# EAGLE design EIB64-ST4-FB-LSplit (EAGLE 9.6.1)
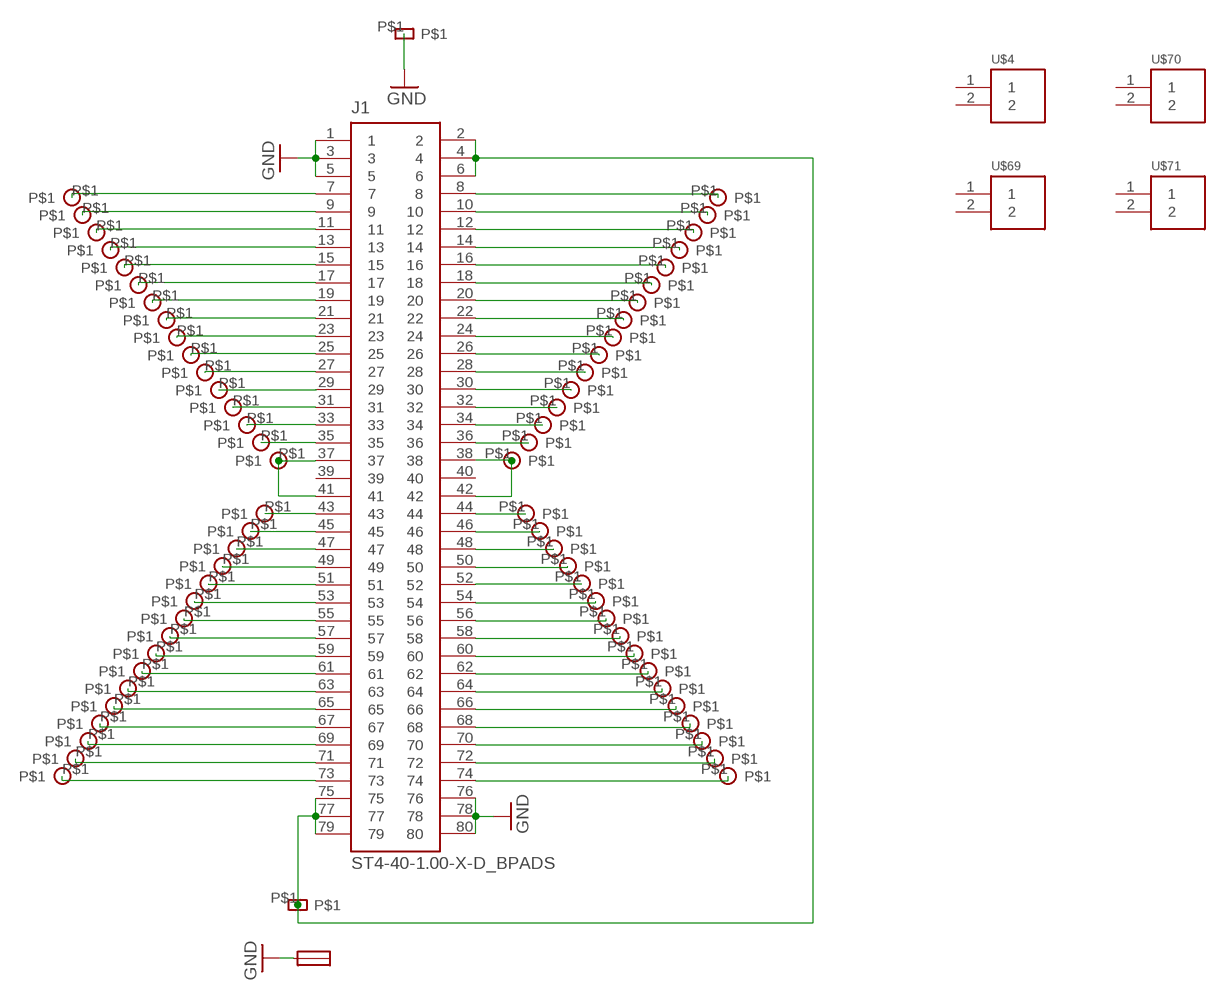
[diagram p0: schematic, sheet 1]

## Parts
J1  ST4-40-1.00-X-D_BPADS  [ST4-40-1.00-X-D_BPADS]
U$1  EIB-GND-HOLE-PAD-SMALL  [EIB-GND-HOLE-PAD-SMALL]
U$2  JMP-PAD-SMALL  [JMP-PAD-SMALL]
U$3  EIB-GND-HOLE-PAD-SMALL  [EIB-GND-HOLE-PAD-SMALL]
U$4  THCONLY_TMS-102-XX-XX-S  [THCONLY_TMS-102-XX-XX-S]
U$5  EIB-TETRODE-HOLE-RS-PAD  [EIB-TETRODE-HOLE-RS-PAD]
U$6  EIB-TETRODE-HOLE-RS-PAD  [EIB-TETRODE-HOLE-RS-PAD]
U$7  EIB-TETRODE-HOLE-RS-PAD  [EIB-TETRODE-HOLE-RS-PAD]
U$8  EIB-TETRODE-HOLE-RS-PAD  [EIB-TETRODE-HOLE-RS-PAD]
U$9  EIB-TETRODE-HOLE-RS-PAD  [EIB-TETRODE-HOLE-RS-PAD]
U$10  EIB-TETRODE-HOLE-RS-PAD  [EIB-TETRODE-HOLE-RS-PAD]
U$11  EIB-TETRODE-HOLE-RS-PAD  [EIB-TETRODE-HOLE-RS-PAD]
U$12  EIB-TETRODE-HOLE-RS-PAD  [EIB-TETRODE-HOLE-RS-PAD]
U$13  EIB-TETRODE-HOLE-RS-PAD  [EIB-TETRODE-HOLE-RS-PAD]
U$14  EIB-TETRODE-HOLE-RS-PAD  [EIB-TETRODE-HOLE-RS-PAD]
U$15  EIB-TETRODE-HOLE-RS-PAD  [EIB-TETRODE-HOLE-RS-PAD]
U$16  EIB-TETRODE-HOLE-RS-PAD  [EIB-TETRODE-HOLE-RS-PAD]
U$17  EIB-TETRODE-HOLE-RS-PAD  [EIB-TETRODE-HOLE-RS-PAD]
U$18  EIB-TETRODE-HOLE-RS-PAD  [EIB-TETRODE-HOLE-RS-PAD]
U$19  EIB-TETRODE-HOLE-RS-PAD  [EIB-TETRODE-HOLE-RS-PAD]
U$20  EIB-TETRODE-HOLE-RS-PAD  [EIB-TETRODE-HOLE-RS-PAD]
U$21  EIB-TETRODE-HOLE-RS-PAD  [EIB-TETRODE-HOLE-RS-PAD]
U$22  EIB-TETRODE-HOLE-RS-PAD  [EIB-TETRODE-HOLE-RS-PAD]
U$23  EIB-TETRODE-HOLE-RS-PAD  [EIB-TETRODE-HOLE-RS-PAD]
U$24  EIB-TETRODE-HOLE-RS-PAD  [EIB-TETRODE-HOLE-RS-PAD]
U$25  EIB-TETRODE-HOLE-RS-PAD  [EIB-TETRODE-HOLE-RS-PAD]
U$26  EIB-TETRODE-HOLE-RS-PAD  [EIB-TETRODE-HOLE-RS-PAD]
U$27  EIB-TETRODE-HOLE-RS-PAD  [EIB-TETRODE-HOLE-RS-PAD]
U$28  EIB-TETRODE-HOLE-RS-PAD  [EIB-TETRODE-HOLE-RS-PAD]
U$29  EIB-TETRODE-HOLE-RS-PAD  [EIB-TETRODE-HOLE-RS-PAD]
U$30  EIB-TETRODE-HOLE-RS-PAD  [EIB-TETRODE-HOLE-RS-PAD]
U$31  EIB-TETRODE-HOLE-RS-PAD  [EIB-TETRODE-HOLE-RS-PAD]
U$32  EIB-TETRODE-HOLE-RS-PAD  [EIB-TETRODE-HOLE-RS-PAD]
U$33  EIB-TETRODE-HOLE-RS-PAD  [EIB-TETRODE-HOLE-RS-PAD]
U$34  EIB-TETRODE-HOLE-RS-PAD  [EIB-TETRODE-HOLE-RS-PAD]
U$35  EIB-TETRODE-HOLE-RS-PAD  [EIB-TETRODE-HOLE-RS-PAD]
U$36  EIB-TETRODE-HOLE-RS-PAD  [EIB-TETRODE-HOLE-RS-PAD]
U$37  EIB-TETRODE-HOLE-RS-PAD  [EIB-TETRODE-HOLE-RS-PAD]
U$38  EIB-TETRODE-HOLE-RS-PAD  [EIB-TETRODE-HOLE-RS-PAD]
U$39  EIB-TETRODE-HOLE-RS-PAD  [EIB-TETRODE-HOLE-RS-PAD]
U$40  EIB-TETRODE-HOLE-RS-PAD  [EIB-TETRODE-HOLE-RS-PAD]
U$41  EIB-TETRODE-HOLE-RS-PAD  [EIB-TETRODE-HOLE-RS-PAD]
U$42  EIB-TETRODE-HOLE-RS-PAD  [EIB-TETRODE-HOLE-RS-PAD]
U$43  EIB-TETRODE-HOLE-RS-PAD  [EIB-TETRODE-HOLE-RS-PAD]
U$44  EIB-TETRODE-HOLE-RS-PAD  [EIB-TETRODE-HOLE-RS-PAD]
U$45  EIB-TETRODE-HOLE-RS-PAD  [EIB-TETRODE-HOLE-RS-PAD]
U$46  EIB-TETRODE-HOLE-RS-PAD  [EIB-TETRODE-HOLE-RS-PAD]
U$47  EIB-TETRODE-HOLE-RS-PAD  [EIB-TETRODE-HOLE-RS-PAD]
U$48  EIB-TETRODE-HOLE-RS-PAD  [EIB-TETRODE-HOLE-RS-PAD]
U$49  EIB-TETRODE-HOLE-RS-PAD  [EIB-TETRODE-HOLE-RS-PAD]
U$50  EIB-TETRODE-HOLE-RS-PAD  [EIB-TETRODE-HOLE-RS-PAD]
U$51  EIB-TETRODE-HOLE-RS-PAD  [EIB-TETRODE-HOLE-RS-PAD]
U$52  EIB-TETRODE-HOLE-RS-PAD  [EIB-TETRODE-HOLE-RS-PAD]
U$53  EIB-TETRODE-HOLE-RS-PAD  [EIB-TETRODE-HOLE-RS-PAD]
U$54  EIB-TETRODE-HOLE-RS-PAD  [EIB-TETRODE-HOLE-RS-PAD]
U$55  EIB-TETRODE-HOLE-RS-PAD  [EIB-TETRODE-HOLE-RS-PAD]
U$56  EIB-TETRODE-HOLE-RS-PAD  [EIB-TETRODE-HOLE-RS-PAD]
U$57  EIB-TETRODE-HOLE-RS-PAD  [EIB-TETRODE-HOLE-RS-PAD]
U$58  EIB-TETRODE-HOLE-RS-PAD  [EIB-TETRODE-HOLE-RS-PAD]
U$59  EIB-TETRODE-HOLE-RS-PAD  [EIB-TETRODE-HOLE-RS-PAD]
U$60  EIB-TETRODE-HOLE-RS-PAD  [EIB-TETRODE-HOLE-RS-PAD]
U$61  EIB-TETRODE-HOLE-RS-PAD  [EIB-TETRODE-HOLE-RS-PAD]
U$62  EIB-TETRODE-HOLE-RS-PAD  [EIB-TETRODE-HOLE-RS-PAD]
U$63  EIB-TETRODE-HOLE-RS-PAD  [EIB-TETRODE-HOLE-RS-PAD]
U$64  EIB-TETRODE-HOLE-RS-PAD  [EIB-TETRODE-HOLE-RS-PAD]
U$65  EIB-TETRODE-HOLE-RS-PAD  [EIB-TETRODE-HOLE-RS-PAD]
U$66  EIB-TETRODE-HOLE-RS-PAD  [EIB-TETRODE-HOLE-RS-PAD]
U$67  EIB-TETRODE-HOLE-RS-PAD  [EIB-TETRODE-HOLE-RS-PAD]
U$68  EIB-TETRODE-HOLE-RS-PAD  [EIB-TETRODE-HOLE-RS-PAD]
U$69  THCONLY_TMS-102-XX-XX-S  [THCONLY_TMS-102-XX-XX-S]
U$70  THCONLY_TMS-102-XX-XX-S  [THCONLY_TMS-102-XX-XX-S]
U$71  THCONLY_TMS-102-XX-XX-S  [THCONLY_TMS-102-XX-XX-S]

## Nets
GND [thick]: J1.1 J1.3 J1.5 J1.76 J1.78 J1.80 U$1.P$1 U$2.P$1
N$1 [thick]: J1.2 J1.4 J1.6 J1.75 J1.77 J1.79 U$3.P$1
N$2 [thick]: J1.35 U$7.P$1
N$3 [thick]: J1.36 U$5.P$1
N$4 [thick]: J1.34 U$9.P$1
N$5 [thick]: J1.20 U$16.P$1
N$6 [thick]: J1.22 U$15.P$1
N$7 [thick]: J1.24 U$14.P$1
N$8 [thick]: J1.26 U$13.P$1
N$9 [thick]: J1.28 U$12.P$1
N$13 [thick]: J1.30 U$11.P$1
N$14 [thick]: J1.37 J1.41 U$8.P$1
N$15 [thick]: J1.32 U$10.P$1
N$16 [thick]: J1.74 U$52.P$1
N$17 [thick]: J1.18 U$17.P$1
N$18 [thick]: J1.16 U$18.P$1
N$19 [thick]: J1.14 U$19.P$1
N$20 [thick]: J1.12 U$20.P$1
N$21 [thick]: J1.10 U$21.P$1
N$22 [thick]: J1.8 U$22.P$1
N$23 [thick]: J1.33 U$23.P$1
N$24 [thick]: J1.31 U$24.P$1
N$25 [thick]: J1.29 U$25.P$1
N$26 [thick]: J1.27 U$26.P$1
N$27 [thick]: J1.25 U$27.P$1
N$28 [thick]: J1.23 U$28.P$1
N$29 [thick]: J1.21 U$29.P$1
N$30 [thick]: J1.19 U$30.P$1
N$31 [thick]: J1.17 U$31.P$1
N$32 [thick]: J1.15 U$32.P$1
N$33 [thick]: J1.13 U$33.P$1
N$34 [thick]: J1.11 U$34.P$1
N$35 [thick]: J1.9 U$35.P$1
N$36 [thick]: J1.7 U$36.P$1
N$37 [thick]: J1.72 U$51.P$1
N$38 [thick]: J1.70 U$50.P$1
N$39 [thick]: J1.68 U$49.P$1
N$40 [thick]: J1.66 U$48.P$1
N$41 [thick]: J1.64 U$47.P$1
N$42 [thick]: J1.62 U$46.P$1
N$43 [thick]: J1.60 U$45.P$1
N$44 [thick]: J1.58 U$44.P$1
N$45 [thick]: J1.56 U$43.P$1
N$46 [thick]: J1.54 U$42.P$1
N$47 [thick]: J1.52 U$41.P$1
N$48 [thick]: J1.50 U$40.P$1
N$49 [thick]: J1.48 U$39.P$1
N$50 [thick]: J1.46 U$38.P$1
N$51 [thick]: J1.44 U$37.P$1
N$52 [thick]: J1.38 J1.42 U$6.P$1
N$53 [thick]: J1.43 U$53.P$1
N$54 [thick]: J1.45 U$54.P$1
N$55 [thick]: J1.47 U$55.P$1
N$56 [thick]: J1.49 U$56.P$1
N$57 [thick]: J1.51 U$57.P$1
N$58 [thick]: J1.53 U$58.P$1
N$59 [thick]: J1.55 U$59.P$1
N$60 [thick]: J1.57 U$60.P$1
N$61 [thick]: J1.59 U$61.P$1
N$62 [thick]: J1.61 U$62.P$1
N$63 [thick]: J1.63 U$63.P$1
N$64 [thick]: J1.65 U$64.P$1
N$65 [thick]: J1.67 U$65.P$1
N$66 [thick]: J1.69 U$66.P$1
N$67 [thick]: J1.71 U$67.P$1
N$68 [thick]: J1.73 U$68.P$1
Unconnected: J1.39 J1.40 U$4.1 U$4.2 U$69.1 U$69.2 U$70.1 U$70.2 U$71.1 U$71.2

## Library data of the parts
J1 = ST4-40-1.00-X-D_custom:ST4-40-1.00-X-D_BPADS: 0.4MM TERMINAL STRIP ASSEMBLY.
U$1 U$3 = EIBLibrary:EIB-GND-HOLE-PAD-SMALL
U$2 = EIBLibrary:JMP-PAD-SMALL
U$4 U$69-U$71 = TMS-108+114-XX-XX-S:THCONLY_TMS-102-XX-XX-S
U$5-U$68 = EIBLibrary:EIB-TETRODE-HOLE-RS-PAD

## Net classes
1 thick: width 0.102 mm

## Board
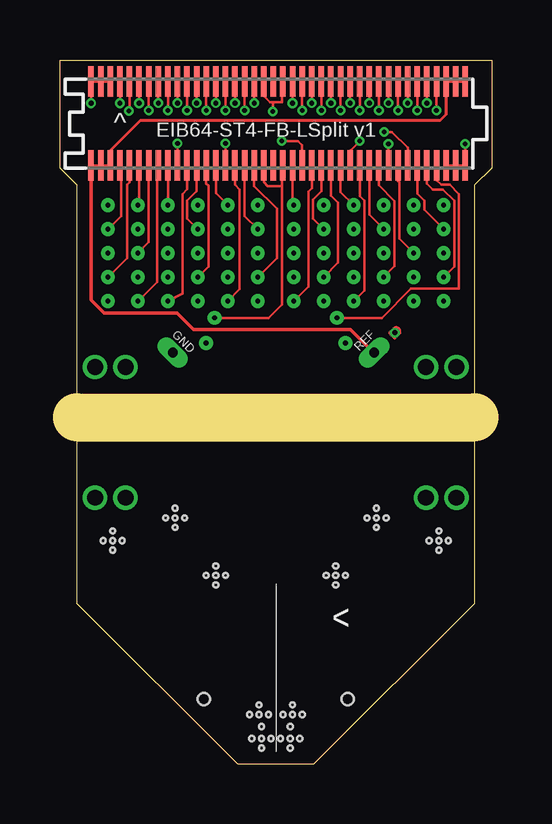
[diagram p1: board, top side]
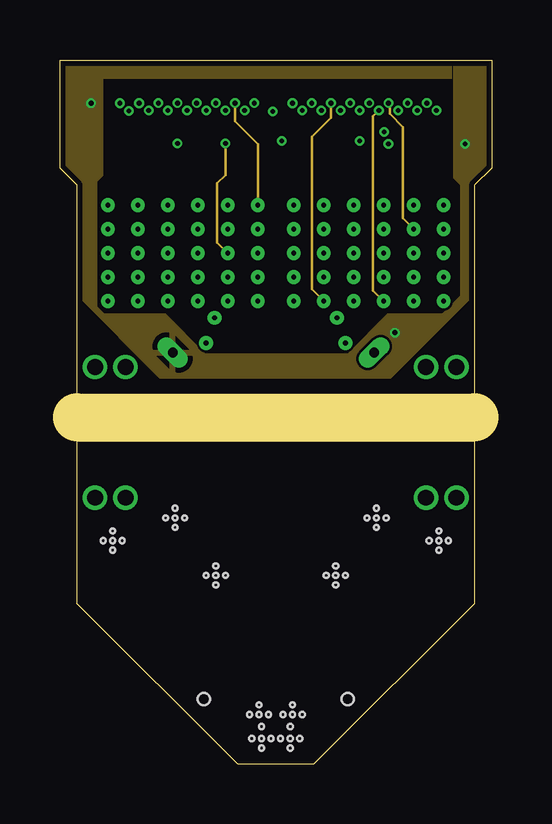
[diagram p2: board, inner layer Route2]
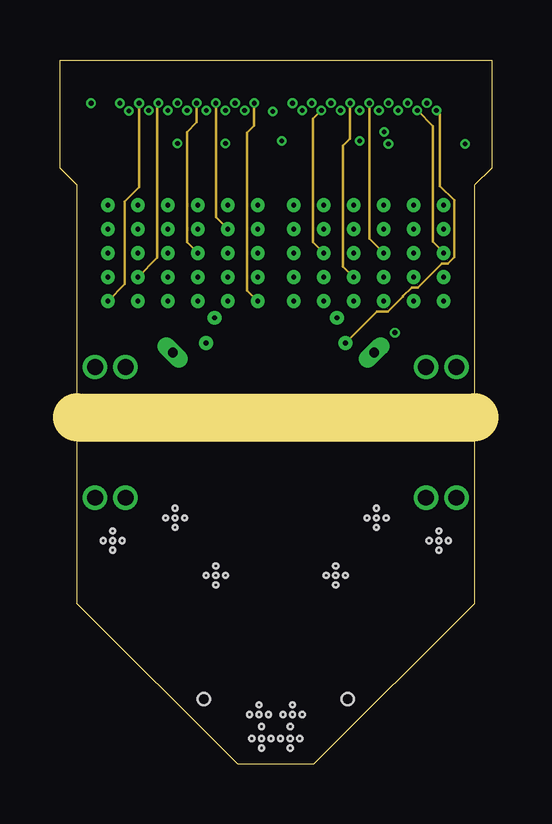
[diagram p3: board, inner layer Route15]
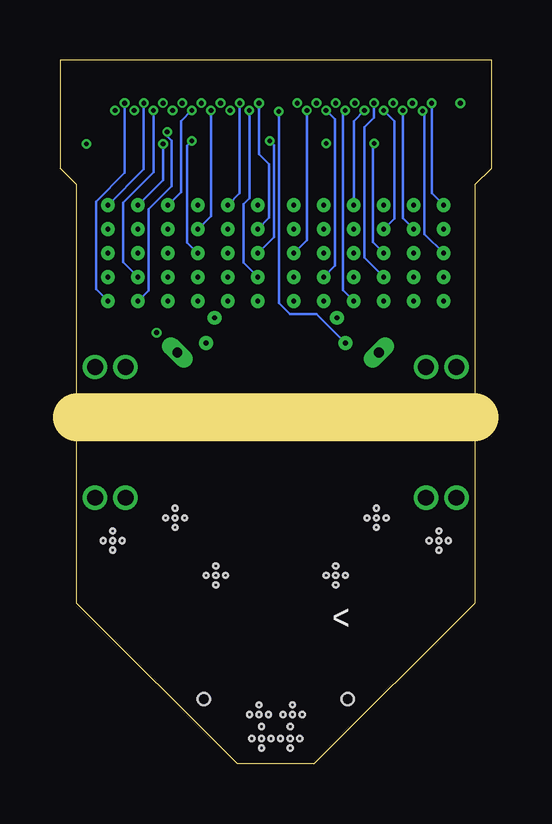
[diagram p4: board, bottom side, seen from below]

Size 18 x 29.35 mm. Coordinates in mm from the lower left corner, seen from the top.
Outline: 0,29.35 18,29.35 18,24.85 17.3,24.15 17.3,6.7 10.6,0 7.4,0 0.7,6.7 0.7,24.15 0,24.85 0,29.35
Copper layers (1+2*15+16): Top 0.018mm / dielectric 0.36mm / Route2 0.035mm / dielectric 0.71mm / Route15 0.035mm / dielectric 0.36mm / Bottom 0.018mm
Design rules "Multi-CB_4L_100um-Tracks_OL35um-IL35um": minimum track width 0.1mm, minimum drill 0.2mm, track to track 0.1mm, track to pad 0.1mm, pad to pad 0.1mm, via to via 0.1mm, smd to smd 0mil, copper to edge 0.2mm, drill to drill 0.2mm, minimum pad ring 0.125mm, minimum via ring 0.1mm, stop-mask expansion 2mil, vias tented up to drill 0.45mm, thermal gap 0.2mm
Holes 0.2 mm at 8.4,1.06 8.3,2.06 6.5,7.86 11.5,7.86 2.2,9.31 15.8,9.31 4.8,10.26 13.2,10.26 6.5,7.46 6.9,7.86 6.5,8.26 6.1,7.86 11.5,7.46 11.9,7.86 11.5,8.26 11.1,7.86 2.2,8.91 2.6,9.31 2.2,9.71 1.8,9.31 4.8,9.86 5.2,10.26 4.8,10.66 4.4,10.26 13.2,9.86 13.6,10.26 13.2,10.66 12.8,10.26 15.8,8.91 16.2,9.31 15.8,9.71 15.4,9.31 8.4,1.56 8.7,2.06 8.3,2.46 7.9,2.06 8.4,0.66 8.8,1.06 8,1.06 9.7,2.06 9.6,1.06 9.6,0.66 9.6,1.56 10,1.06 9.2,1.06 10.1,2.06 9.3,2.06 9.7,2.46
Holes 0.5 mm at 6,2.7 12,2.7
Milling: 1 lines

### Footprints (pad centres in the part's own frame; a part is rotated, then mirrored left to right if it is on the bottom)
ST4-40-1.00-X-D_BPADS = smd 0.23 x 1.28: 1 -7.8,1.75; 3 -7.4,1.75; 4 -7.4,-1.75; 5 -7,1.75; 6 -7,-1.75; 7 -6.6,1.75; 8 -6.6,-1.75; 9 -6.2,1.75; 10 -6.2,-1.75; 11 -5.8,1.75; 12 -5.8,-1.75; 13 -5.4,1.75; 14 -5.4,-1.75; 15 -5,1.75; 16 -5,-1.75; 17 -4.6,1.75; 18 -4.6,-1.75; 19 -4.2,1.75; 20 -4.2,-1.75; 21 -3.8,1.75; 22 -3.8,-1.75; 23 -3.4,1.75; 24 -3.4,-1.75; 25 -3,1.75; 26 -3,-1.75; 27 -2.6,1.75; 28 -2.6,-1.75; 29 -2.2,1.75; 30 -2.2,-1.75; 31 -1.8,1.75; 32 -1.8,-1.75; 33 -1.4,1.75; 34 -1.4,-1.75; 35 -1,1.75; 36 -1,-1.75; 37 -0.6,1.75; 38 -0.6,-1.75; 39 -0.2,1.75; 40 -0.2,-1.75; 41 0.2,1.75; 42 0.2,-1.75; 43 0.6,1.75; 44 0.6,-1.75; 45 1,1.75; 46 1,-1.75; 47 1.4,1.75; 48 1.4,-1.75; 49 1.8,1.75; 50 1.8,-1.75; 51 2.2,1.75; 52 2.2,-1.75; 53 2.6,1.75; 54 2.6,-1.75; 55 3,1.75; 56 3,-1.75; 57 3.4,1.75; 58 3.4,-1.75; 59 3.8,1.75; 60 3.8,-1.75; 61 4.2,1.75; 62 4.2,-1.75; 63 4.6,1.75; 64 4.6,-1.75; 65 5,1.75; 66 5,-1.75; 67 5.4,1.75; 68 5.4,-1.75; 69 5.8,1.75; 70 5.8,-1.75; 71 6.2,1.75; 72 6.2,-1.75; 73 6.6,1.75; 74 6.6,-1.75; 75 7,1.75; 76 7,-1.75; 77 7.4,1.75; 78 7.4,-1.75; 79 7.8,1.75; 80 7.8,-1.75 | smd 0.23 x 1.26: 2 -7.8,-1.75
EIB-GND-HOLE-PAD-SMALL = drill 0.4 pad 0.76 long: P$1 0,0
JMP-PAD-SMALL = smd 0.305 x 0.152: P$1 0.1,0
THCONLY_TMS-102-XX-XX-S = drill 0.66 pad 1.016: 1 -0.635,0; 2 0.635,0
EIB-TETRODE-HOLE-RS-PAD = drill 0.2 pad 0.58: P$1 0,0

### Placement (x,y rotation side)
J1  9.1,26.7 0 top
U$1  4.7,17.15 135 top
U$2  13.85,17.86 45 top
U$3  13.1,17.15 45 top
U$4  15.9,16.55 0 top
U$5  8.25,20.3 270 top
U$6  6.45,18.6 0 top
U$7  8.25,19.3 0 top
U$8  6.1,17.55 0 top
U$9  8.25,22.3 0 top
U$10  7,19.3 0 top
U$11  7,21.3 211.3 top
U$12  7,23.3 180 top
U$13  5.75,20.3 0 top
U$14  5.75,22.3 0 top
U$15  4.5,19.3 0 top
U$16  4.5,21.3 0 top
U$17  4.5,23.3 0 top
U$18  3.25,19.3 293.7 top
U$19  3.25,21.3 90 top
U$20  3.25,23.3 0 top
U$21  2,20.3 0 top
U$22  2,22.3 0 top
U$23  8.25,21.3 0 top
U$24  8.25,23.3 0 top
U$25  7,20.3 0 top
U$26  7,22.3 0 top
U$27  5.75,19.3 0 top
U$28  5.75,21.3 0 top
U$29  5.75,23.3 0 top
U$30  4.5,20.3 0 top
U$31  4.5,22.3 0 top
U$32  3.25,20.3 0 top
U$33  3.25,22.3 0 top
U$34  2,19.3 0 top
U$35  2,21.3 0 top
U$36  2,23.3 0 top
U$37  9.75,23.3 0 top
U$38  9.75,21.3 0 top
U$39  9.75,19.3 0 top
U$40  11,22.3 0 top
U$41  11,20.3 0 top
U$42  12.25,23.3 0 top
U$43  12.25,21.3 0 top
U$44  12.25,19.3 0 top
U$45  13.5,22.3 0 top
U$46  13.5,20.3 0 top
U$47  14.75,23.3 0 top
U$48  14.75,21.3 0 top
U$49  14.75,19.3 0 top
U$50  16,22.3 0 top
U$51  16,20.3 0 top
U$52  11.55,18.6 0 top
U$53  9.75,22.3 0 top
U$54  9.75,20.3 0 top
U$55  11,23.3 0 top
U$56  11,21.3 0 top
U$57  11,19.3 0 top
U$58  12.25,22.3 0 top
U$59  12.25,20.3 0 top
U$60  13.5,23.3 0 top
U$61  13.5,21.3 0 top
U$62  13.5,19.3 0 top
U$63  14.75,22.3 0 top
U$64  14.75,20.3 0 top
U$65  16,23.3 0 top
U$66  16,21.3 0 top
U$67  16,19.3 0 top
U$68  11.9,17.55 0 top
U$69  15.9,11.1 0 top
U$70  2.1,16.55 0 top
U$71  2.1,11.1 0 top

### Tracks (layer width: path | path; a pad name or v marks a point on that pad's centre or on a via)
GND  (via drill 0.2)
  Top 0.102: J1.5 J1.3 J1.1 v1.3,27.55 | J1.76 J1.78 J1.80 v16.9,25.85 | v13.97,17.98 U$2.P$1
  pour Route2: 0.1,29.25 0.1,24.85 0.75,24.2 0.75,19.5 4.15,16.1 13.8,16.1 17.25,19.55 17.25,24.2 17.9,24.85 17.9,29.25 16.4,29.25 16.4,24.45 16.7,24.15 16.7,19.5 15.95,18.75 13.65,18.75 12,17.1 6.05,17.1 4.4,18.75 1.85,18.75 1.55,19.05 1.55,24.3 1.8,24.55 1.8,28.6 16.35,28.6 16.35,29.25
N$1
  Top 0.102: J1.2 J1.4 J1.6 2.1,25.58 | J1.75 J1.77 J1.79
  Top 0.12: 2.1,25.58 3.35,26.83 15.85,26.83 16.1,27.08 J1.75
  Top 0.14: U$3.P$1 13.08,17.15 12.12,18.11 5.57,18.11 4.88,18.8 1.85,18.8 1.3,19.35 J1.2
N$2  (via drill 0.2)
  Top 0.102: J1.35 v8.1,27.56 v8.1,27.55
  Route15 0.102: U$7.P$1 7.81,19.74 7.81,26.31 8.1,26.6 v8.1,27.55
N$3
  Top 0.102: U$5.P$1 9.05,21.1 9.05,23.15 8.1,24.1 J1.36
N$4
  Top 0.102: J1.34 7.7,22.85 U$9.P$1
N$5  (via drill 0.2)
  Top 0.102: J1.20 v4.9,25.88
  Bottom 0.102: U$16.P$1 4.95,21.75 4.95,25.83 v4.9,25.88
N$6
  Top 0.102: U$15.P$1 5.11,19.6 5.11,23.77 5.3,23.96 J1.22
N$7
  Top 0.102: J1.24 5.7,23.87 5.31,23.48 5.31,22.74 U$14.P$1
N$8
  Top 0.102: U$13.P$1 6.19,20.74 6.19,24.11 6.1,24.2 J1.26
N$9
  Top 0.102: U$12.P$1 6.5,23.8 J1.28
N$13  (via drill 0.2)
  Top 0.102: J1.30 v6.9,25.88
  Route2 0.102: U$11.P$1 6.56,21.74 6.56,24.21 6.9,24.55 v6.9,25.88
N$14  (via drill 0.2)
  Top 0.102: 8.88,27.6 v8.88,27.2 | 8.88,27.6 8.75,27.6 8.5,27.85 J1.37 | 8.88,27.6 9.25,27.6 9.25,28.35 J1.41
  Bottom 0.102: v8.88,27.2 8.88,19.23 8.4,18.75 7.3,18.75 U$8.P$1
N$15
  Top 0.102: U$10.P$1 7.5,19.8 7.5,23.95 7.3,24.15 J1.32
N$16
  Top 0.102: J1.74 15.7,24.35 15.9,24.15 16.26,24.15 16.64,23.77 16.64,19.81 14.64,19.81 13.43,18.6 U$52.P$1
N$17
  Top 0.102: J1.18 U$17.P$1
N$18
  Top 0.102: J1.16 4.12,24.85 4.05,24.77 4.05,20.1 U$18.P$1
N$19
  Top 0.102: J1.14 3.7,21.75 U$19.P$1
N$20
  Top 0.102: J1.12 3.3,23.35 U$20.P$1
N$21
  Top 0.102: U$21.P$1 2.8,21.1 2.8,24.15 2.9,24.25 J1.10
N$22
  Top 0.102: J1.8 2.55,24.9 2.55,22.85 U$22.P$1
N$23  (via drill 0.2)
  Top 0.102: J1.33 v7.7,27.25
  Bottom 0.102: v7.7,27.25 7.7,21.85 U$23.P$1
N$24  (via drill 0.2)
  Top 0.102: J1.31 v7.3,27.56 v7.3,27.55
  Route2 0.102: v7.3,27.55 7.3,26.8 8.25,25.85 U$24.P$1
N$25  (via drill 0.2)
  Top 0.102: J1.29 v6.9,27.25
  Bottom 0.102: v6.9,27.25 6.53,26.87 6.53,20.77 U$25.P$1
N$26  (via drill 0.2)
  Top 0.102: J1.27 v6.5,27.56 v6.5,27.55
  Route15 0.102: U$26.P$1 6.5,22.8 v6.5,27.55
N$27  (via drill 0.2)
  Top 0.102: J1.25 v6.1,27.25
  Bottom 0.102: U$27.P$1 6.2,19.75 6.2,27.15 v6.1,27.25
N$28  (via drill 0.2)
  Top 0.102: J1.23 v5.7,27.56 v5.7,27.55
  Route15 0.102: U$28.P$1 5.3,21.75 5.3,26.35 5.7,26.75 v5.7,27.55
N$29  (via drill 0.2)
  Top 0.102: J1.21 v5.3,27.25
  Bottom 0.102: U$29.P$1 5.75,26.8 v5.3,27.25
N$30  (via drill 0.2)
  Top 0.102: J1.19 v4.9,27.56 v4.9,27.55
  Bottom 0.102: U$30.P$1 5.3,21.1 5.3,26.55 4.9,26.95 v4.9,27.55
N$31  (via drill 0.2)
  Top 0.102: J1.17 v4.5,27.25
  Bottom 0.102: v4.5,27.25 4.06,26.8 4.06,22.74 U$31.P$1
N$32  (via drill 0.2)
  Top 0.102: J1.15 v4.1,27.56 v4.1,27.55
  Route15 0.102: v4.1,27.55 4.05,27.5 4.05,21.1 U$32.P$1
N$33  (via drill 0.2)
  Top 0.102: J1.13 v3.7,27.25
  Bottom 0.102: U$33.P$1 3.7,22.75 v3.7,27.25
N$34  (via drill 0.2)
  Top 0.102: J1.11 v3.3,27.55
  Route15 0.102: v3.3,27.55 3.3,24.05 2.7,23.45 2.7,20 U$34.P$1
N$35  (via drill 0.2)
  Top 0.102: J1.9 2.9,27.24 v2.88,27.22
  Bottom 0.102: U$35.P$1 2.8,22.1 2.8,27.14 v2.88,27.22
N$36  (via drill 0.2)
  Top 0.102: J1.7 v2.5,27.55
  Bottom 0.102: v2.5,27.55 2.5,23.8 U$36.P$1
N$37
  Top 0.102: U$51.P$1 16.44,20.74 16.44,23.48 15.97,23.95 15.55,23.95 15.3,24.2 J1.72
N$38
  Top 0.102: U$50.P$1 15.19,23.11 15.19,23.48 14.9,23.77 J1.70
N$39  (via drill 0.2)
  Top 0.102: v13.53,26.35 13.85,26.35 14.5,25.7 J1.68
  Bottom 0.102: v13.53,26.35 13.53,26.17 13.35,25.99 13.35,25.7 13.35,24.1 14.31,23.14 14.31,19.74 U$49.P$1
N$40
  Top 0.102: J1.66 14.1,24.3 14.15,24.25 14.15,21.9 U$48.P$1
N$41  (via drill 0.2)
  Top 0.102: J1.64 v13.7,25.85
  Bottom 0.102: v13.7,25.85 13.7,24.35 U$47.P$1
N$42
  Top 0.102: J1.62 13.3,24.12 13.95,23.47 13.95,20.75 U$46.P$1
N$43
  Top 0.102: U$45.P$1 12.9,22.9 J1.60
N$44
  Top 0.102: J1.58 12.5,23.67 12.69,23.48 12.69,19.74 U$44.P$1
N$45  (via drill 0.2)
  Top 0.102: v12.5,25.98 12.12,25.6 12.12,24.98 J1.56
  Bottom 0.102: U$43.P$1 12.69,21.74 12.69,25.78 v12.5,25.98
N$46
  Top 0.102: U$42.P$1 11.7,23.85 J1.54
N$47
  Top 0.102: U$41.P$1 11.6,20.9 11.6,23.4 11.3,23.7 J1.52
N$48
  Top 0.102: J1.50 10.9,23.87 10.56,23.53 10.56,22.74 U$40.P$1
N$49
  Top 0.102: J1.48 10.5,24.01 10.36,23.87 10.36,19.91 U$39.P$1
N$50  (via drill 0.2)
  Top 0.102: J1.46 10.1,25.8 9.93,25.98 v9.25,25.98
  Bottom 0.102: v9.25,25.98 9.08,25.8 9.08,21.97 U$38.P$1
N$51
  Top 0.102: J1.44 9.7,23.35 U$37.P$1
N$52
  Top 0.102: 9.25,24.1 9.25,24.85 J1.42 | J1.38 8.5,24.25 8.65,24.1 9.25,24.1 | 9.25,24.1 9.25,19.15 8.7,18.6 U$6.P$1
N$53  (via drill 0.2)
  Top 0.102: J1.43 v9.7,27.55
  Bottom 0.102: U$53.P$1 9.28,22.77 9.28,25 9.7,25.42 v9.7,27.55
N$54  (via drill 0.2)
  Top 0.102: J1.45 v10.1,27.25
  Bottom 0.102: v10.1,27.25 10.1,23.6 10.35,23.35 10.35,20.9 U$54.P$1
N$55  (via drill 0.2)
  Top 0.102: J1.47 v10.5,27.56 v10.5,27.55
  Bottom 0.102: U$55.P$1 10.5,23.8 v10.5,27.55
N$56  (via drill 0.2)
  Top 0.102: J1.49 v10.9,27.25
  Route15 0.102: U$56.P$1 10.55,21.75 10.55,26.89 v10.9,27.25
N$57  (via drill 0.2)
  Top 0.102: J1.51 v11.3,27.56 v11.3,27.55
  Route2 0.102: v11.3,27.55 11.3,26.95 10.5,26.15 10.5,19.8 U$57.P$1
N$58  (via drill 0.2)
  Top 0.102: J1.53 v11.7,27.25
  Bottom 0.102: v11.7,27.25 11.7,22.85 U$58.P$1
N$59  (via drill 0.2)
  Top 0.102: J1.55 v12.1,27.56 v12.1,27.55
  Route15 0.102: v12.1,27.55 12.1,26.08 11.81,25.78 11.81,20.74 U$59.P$1
N$60  (via drill 0.2)
  Top 0.102: J1.57 v12.5,27.25
  Bottom 0.102: U$60.P$1 12.95,23.85 12.95,26.8 v12.5,27.25
N$61  (via drill 0.2)
  Top 0.102: J1.59 v12.9,27.56 v12.9,27.55
  Route15 0.102: U$61.P$1 12.9,21.9 v12.9,27.55
N$62  (via drill 0.2)
  Top 0.102: J1.61 v13.3,27.25
  Route2 0.102: U$62.P$1 13.06,19.74 13.06,27 v13.3,27.25
N$63  (via drill 0.2)
  Top 0.102: J1.63 v13.7,27.56 v13.7,27.55
  Route2 0.102: U$63.P$1 14.3,22.75 14.3,26.55 13.75,27.1 13.75,27.5 v13.7,27.55
N$64  (via drill 0.2)
  Top 0.102: J1.65 v14.1,27.25
  Bottom 0.102: v14.1,27.25 14.1,24.67 15.38,23.4 15.38,20.92 U$64.P$1
N$65  (via drill 0.2)
  Top 0.102: J1.67 v14.5,27.56 v14.5,27.55
  Bottom 0.102: U$65.P$1 14.5,24.8 v14.5,27.55
N$66  (via drill 0.2)
  Top 0.102: J1.69 v14.9,27.25
  Route15 0.102: U$66.P$1 16,21.33 15.56,21.77 15.56,26.59 v14.9,27.25
N$67  (via drill 0.2)
  Top 0.102: J1.71 v15.3,27.56 v15.3,27.55
  Bottom 0.102: v15.3,27.55 15.3,24.65 16.5,23.45 16.5,19.8 U$67.P$1
N$68  (via drill 0.2)
  Top 0.102: J1.73 v15.7,27.25
  Route15 0.102: v15.7,27.25 15.85,27.1 15.85,24.1 16.45,23.5 16.45,21.13 16.18,20.86 15.93,20.86 14.93,19.86 14.67,19.86 14.31,19.5 14.31,19.49 13.68,18.86 13.21,18.86 U$68.P$1

### Text on the board
tNames: ^ | EIB64-ST4-FB-LSplit v1 | REF | GND | ^
bNames: ^